# Altium schematic sheet Neon-Demon-Earing-revE.SchDoc
size A4; SheetNumber: 1; SheetTotal: 1
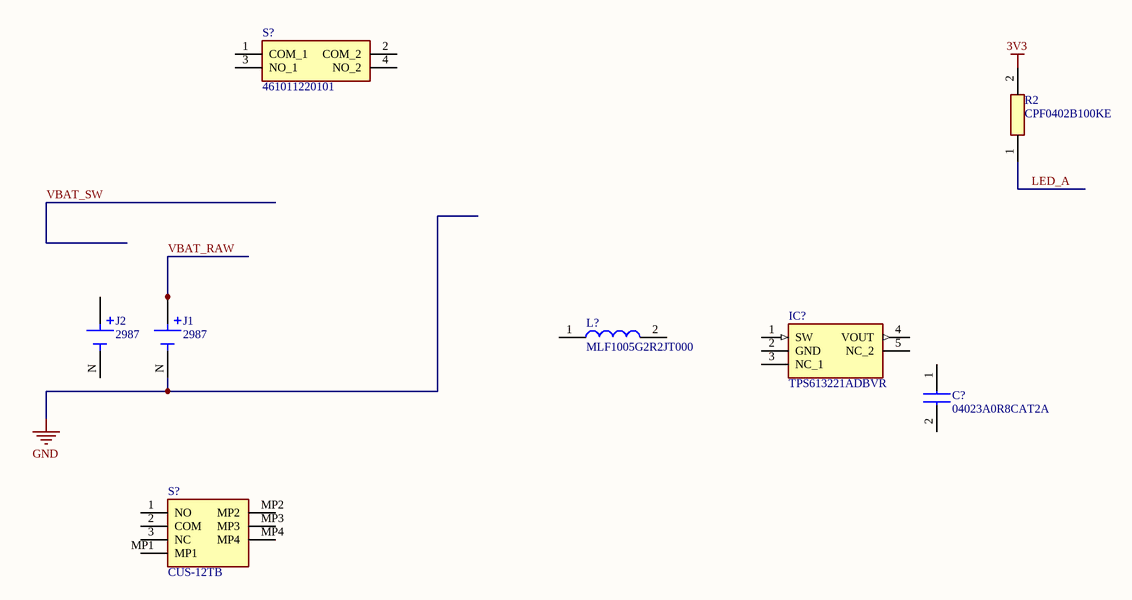
[diagram p0: Neon-Demon-Earing-revE.SchDoc]

## Parts
(Parts that share a designator on the sheet are numbered #1, #2 ... from top to bottom, then left to right.)
C?  04023A0R8CAT2A  [CAPC1005X56N]
IC?  TPS613221ADBVR  [SOT95P280X145-5N]
J1  2987  [BAT_2987]
J2  2987  [BAT_2987]
L?  MLF1005G2R2JT000  [INDC1005X55N]
R2  CPF0402B100KE  [RESC1005X35N]
S?#1  461011220101  [461011220101]
S?#2  CUS-12TB  [CUS12TB]

## Nets
3V3: R2.2
GND: J1.N(NEG)
LED_A: R2.1
VBAT_RAW: J1.P1(POS) J1.P2(POS)
NetJ2_P1: J2.P1(POS) J2.P2(POS)

Not connected (* = marked no-connect by the designer): C? 1 2; IC? 1(SW) 2(GND) 3(NC_1) 4(VOUT) 5(NC_2); J2 N(NEG); L? 1 2; S?#1 1(COM_1) 2(COM_2) 3(NO_1) 4(NO_2); S?#2 1(NO) 2(COM) 3(NC) MP1 MP2 MP3 MP4

## Library data of the parts
C? = 04023A0R8CAT2A: Capacitor; Manufacturer_Name: AVX; Datasheet Link: http://www.mouser.com/catalog/supplier/library/pdf/AVXSurfaceMountCeramic.pdf; Height: 0.56mm; Manufacturer_Part_Number: 04023A0R8CAT2A; Mouser Part Number: 581-04023A0R8CAT2A; Mouser Price/Stock: https://www.mouser.co.uk/ProductDetail/AVX/04023A0R8CAT2A?qs=ZwvTZoB9SO%252BVBOZ%252BNMbjzw%3D%3D
IC? = TPS613221ADBVR: Power Supply; Manufacturer_Name: Texas Instruments; Datasheet Link: http://www.ti.com/lit/gpn/tps61322; Height: 1.45mm; Manufacturer_Part_Number: TPS613221ADBVR; Mouser Part Number: 595-TPS613221ADBVR; Mouser Price/Stock: https://www.mouser.co.uk/ProductDetail/Texas-Instruments/TPS613221ADBVR?qs=W0yvOO0ixfEzYGaKZaJgrw%3D%3D; Arrow Part Number: TPS613221ADBVR; Arrow Price/Stock: https://www.arrow.com/en/products/tps613221adbvr/texas-instruments?region=nac
L? = MLF1005G2R2JT000: Inductor; Manufacturer_Name: TDK-Lambda; Datasheet Link: https://product.tdk.com/system/files/dam/doc/product/inductor/inductor/smd/catalog/inductor_commercial_standard_mlf1005_en.pdf; Height: 0.55mm; Manufacturer_Part_Number: MLF1005G2R2JT000; Mouser Part Number: 810-MLF1005G2R2JT000; Mouser Price/Stock: https://www.mouser.co.uk/ProductDetail/TDK/MLF1005G2R2JT000?qs=%2FPzWLGNeQ%252BhXmsvIBrs2gg%3D%3D
R2 = CPF0402B100KE: Resistor; Manufacturer_Name: TE Connectivity; Datasheet Link: http://www.farnell.com/datasheets/1786775.pdf; Height: 0.35mm; Manufacturer_Part_Number: CPF0402B100KE; Mouser Part Number: 279-CPF0402B100KE; Mouser Price/Stock: https://www.mouser.co.uk/ProductDetail/TE-Connectivity-Holsworthy/CPF0402B100KE?qs=CXI0wBT1M2h4W2Gm72yIGA%3D%3D; Arrow Part Number: CPF0402B100KE; Arrow Price/Stock: https://www.arrow.com/en/products/cpf0402b100ke/te-connectivity?region=nac
S?#1 = 461011220101: Switch; Manufacturer_Name: Wurth Elektronik; Datasheet Link: https://www.we-online.com/catalog/datasheet/461011220101.pdf; Height: 3.8mm; Manufacturer_Part_Number: 461011220101; Mouser Part Number: 710-461011220101; Mouser Price/Stock: https://www.mouser.co.uk/ProductDetail/Wurth-Elektronik/461011220101?qs=wr8lucFkNMVAdVKd0FklHQ%3D%3D
S?#2 = CUS-12TB: Switch; Manufacturer_Name: Nidec Copal; Datasheet Link: https://www.nidec-copal-electronics.com/e/catalog/switch/cus.pdf; Height: 1.4mm; Manufacturer_Part_Number: CUS-12TB; Mouser Part Number: 229-CUS-12TB; Mouser Price/Stock: https://www.mouser.co.uk/ProductDetail/Nidec-Components/CUS-12TB?qs=XeJtXLiO41Q1Ug1dC3Bq%2FQ%3D%3D
J1 J2 = 2987: Package: None; Price: None; Value: *; MP: 2987; Availability: Unavailable